# Altium schematic sheet DAC_32CH.SchDoc: DAC
size 420 x 297 mm; Author: G.K.; CompanyName: WUT; DrawnBy: G.K.; Organization: WUT ISE; Address1: Warsaw Univeristy of Technology; Address2: Nowowiejska 15/19; Revision: -; SheetNumber: -; SheetTotal: -; EDA_Number: ARTIQ; Projet: ARTIQ/SINARA; ModifiedBy: -; CreateDate: XX/XX/XXXX; CheckedDate: -; Title2: & reference; DivGrp: ISE; Designer: G.K.; ModifiedDate: -; ProjectName: 32 CHANNEL 16bit DAC
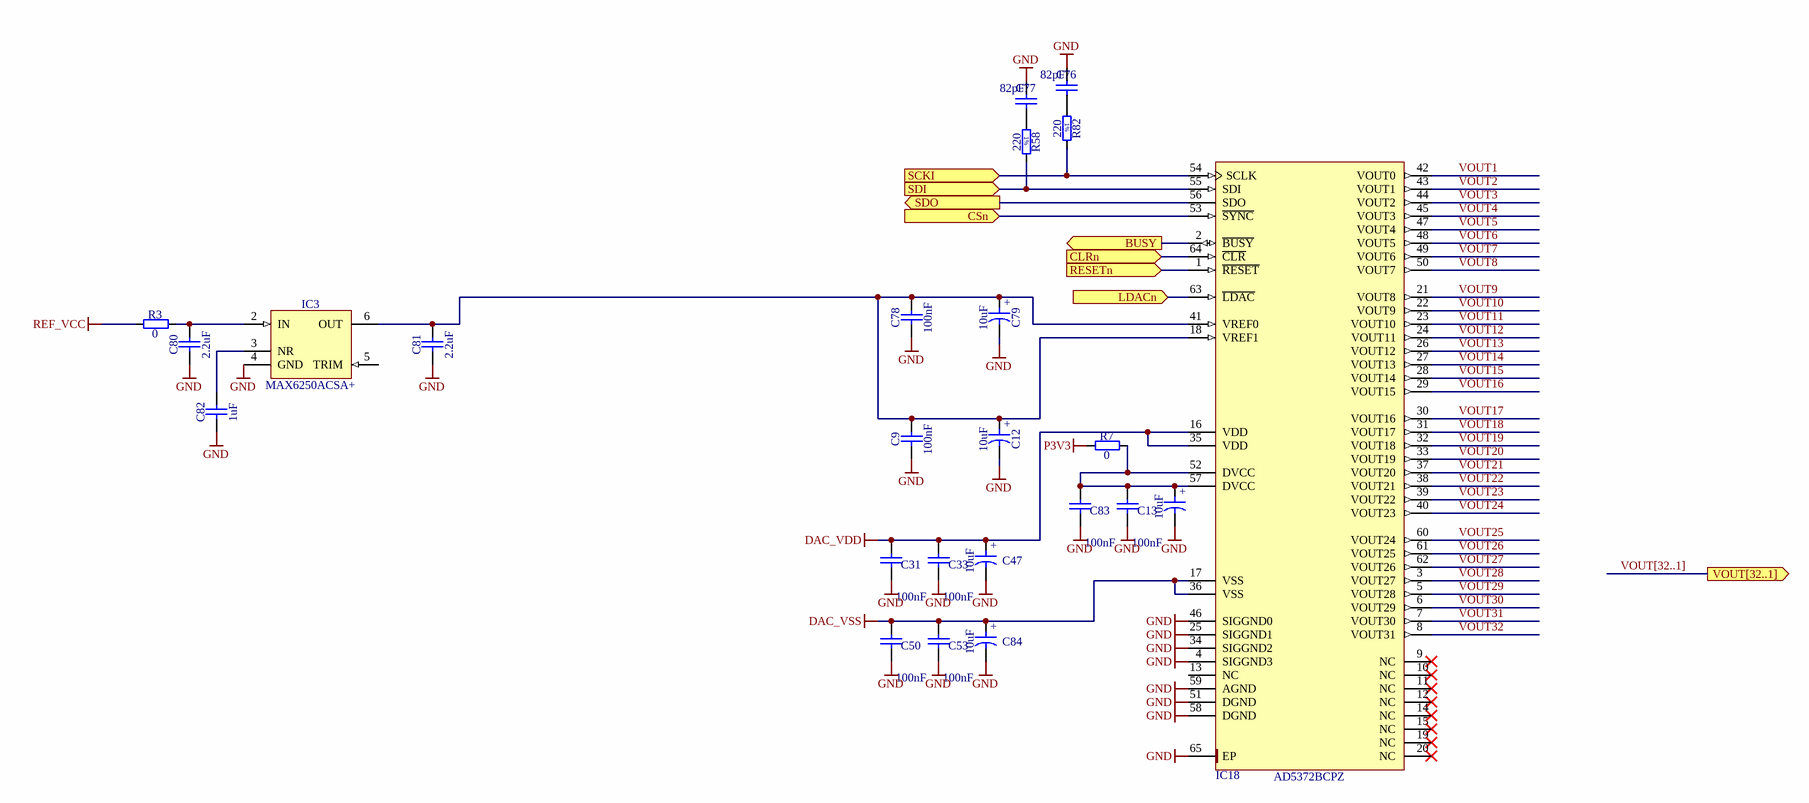
[diagram p0: DAC_32CH.SchDoc]

## Parts
C9  100nF  [CAPC1005X55N]
C12  10uF  [CAPMP3216X180N]
C13  100nF  [CAPC1005X55N]
C14  10uF  [CAPMP3216X180N]
C31  100nF  [CAPC1005X55N]
C33  100nF  [CAPC1005X55N]
C47  10uF  [CAPMP3216X180N]
C50  100nF  [CAPC1005X55N]
C53  100nF  [CAPC1005X55N]
C76  82pF  [CAPC1608X87N]
C77  82pF  [CAPC1608X87N]
C78  100nF  [CAPC1005X55N]
C79  10uF  [CAPMP3216X180N]
C80  2.2uF  [CAPC1608X87N]
C81  2.2uF  [CAPC1608X87N]
C82  1uF  [CAPC1608X87N]
C83  100nF  [CAPC1005X55N]
C84  10uF  [CAPMP3216X180N]
IC3  MAX6250ACSA+  [SOIC127P600X175-8N]
IC18  AD5372BCPZ  [QFN50P900X900X100-65N-S725]
R3  0  [RESC1005X40N]
R7  0  [RESC1005X40N]
R58  220  [RESC1608X55N]
R82  220  [RESC1608X55N]

## Ports
BUSY (out), CLRn (in), CSn (in), LDACn (in), RESETn (in), SCKI (in), SDI (in), SDO (out), VOUT[32..1] (out)

## Nets
DAC_VDD: C31.2 C33.2 C47.1 IC18.16(VDD) IC18.35(VDD)
DAC_VSS: C50.2 C53.2 C84.1 IC18.17(VSS) IC18.36(VSS)
GND: C9.1 C12.2 C13.1 C14.2 C31.1 C33.1 C47.2 C50.1 C53.1 C76.1 C77.1 C78.1 C79.2 C80.1 C81.1 C82.1 C83.1 C84.2 IC3.4(GND) IC18.4(SIGGND3) IC18.25(SIGGND1) IC18.34(SIGGND2) IC18.46(SIGGND0) IC18.51(DGND) IC18.58(DGND) IC18.59(AGND) IC18.65(EP)
P3V3: R7.1
REF_VCC: R3.1
BUSY: IC18.2(~{BUSY}) ; port BUSY
CLRn: IC18.64(~{CLR}) ; port CLRn
CSn: IC18.53(~{SYNC}) ; port CSn
LDACn: IC18.63(~{LDAC}) ; port LDACn
RESETn: IC18.1(~{RESET}) ; port RESETn
SCKI: IC18.54(SCLK) R82.2 ; port SCKI
SDI: IC18.55(SDI) R58.2 ; port SDI
SDO: IC18.56(SDO) ; port SDO
VOUT1: IC18.42(VOUT0)
VOUT2: IC18.43(VOUT1)
VOUT3: IC18.44(VOUT2)
VOUT4: IC18.45(VOUT3)
VOUT5: IC18.47(VOUT4)
VOUT6: IC18.48(VOUT5)
VOUT7: IC18.49(VOUT6)
VOUT8: IC18.50(VOUT7)
VOUT9: IC18.21(VOUT8)
VOUT10: IC18.22(VOUT9)
VOUT11: IC18.23(VOUT10)
VOUT12: IC18.24(VOUT11)
VOUT13: IC18.26(VOUT12)
VOUT14: IC18.27(VOUT13)
VOUT15: IC18.28(VOUT14)
VOUT16: IC18.29(VOUT15)
VOUT17: IC18.30(VOUT16)
VOUT18: IC18.31(VOUT17)
VOUT19: IC18.32(VOUT18)
VOUT20: IC18.33(VOUT19)
VOUT21: IC18.37(VOUT20)
VOUT22: IC18.38(VOUT21)
VOUT23: IC18.39(VOUT22)
VOUT24: IC18.40(VOUT23)
VOUT25: IC18.60(VOUT24)
VOUT26: IC18.61(VOUT25)
VOUT27: IC18.62(VOUT26)
VOUT28: IC18.3(VOUT27)
VOUT29: IC18.5(VOUT28)
VOUT30: IC18.6(VOUT29)
VOUT31: IC18.7(VOUT30)
VOUT32: IC18.8(VOUT31)
NetC9_2: C9.2 C12.1 C78.2 C79.1 C81.2 IC3.6(OUT) IC18.18(VREF1) IC18.41(VREF0)
NetC13_2: C13.2 C14.1 C83.2 IC18.52(DVCC) IC18.57(DVCC) R7.2
NetC76_2: C76.2 R82.1
NetC77_2: C77.2 R58.1
NetC80_2: C80.2 IC3.2(IN) R3.2
NetC82_2: C82.2 IC3.3(NR)

Not connected (* = marked no-connect by the designer): IC3 5(TRIM); IC18 9(NC)* 10(NC)* 11(NC)* 12(NC)* 13(NC) 14(NC)* 15(NC)* 19(NC)* 20(NC)*

## Buses and harness runs
bus VOUT[32..1] = port VOUT[32..1]

## Notes on the sheet
- Project/Equipment
- Document
- Designer
- Drawn by
- Check.by
- File
- Last Mod.
- Print Date
- Sheet
- Size
- A3
- of
- Rev
- (in symbol CTE3216-18_10UF_16V_20%_AVX_TCJ) +
- (in symbol R0603_220R_1%_0.1W_100PPM) 1%

## Library data of the parts
C9 C13 C31 C33 C50 C53 C78 C83 = CC0402_100NF_16V_10%_X7R: Non-polarised capacitor; Part Description: SMD Multilayer Chip Ceramic Capacitor; Manufacturer: GENERIC; Manufacturer1 Part Number: GRM155R71C104KA88D; Voltage: 16V; TC: X7R; Tolerance: ±10%; Part Number: CC0402_100NF_16V_10%_X7R; Component Kind: Standard; Component Type: Standard; Pin Count: 2; Value: 100nF; Status: Not Recommended; Manufacturer Part Number: CC0402_100NF_16V_10%_X7R; Case: 0402; Mounted: Yes; Socket: No; SMD: Yes; Sense: No; Manufacturer1 Example: MURATA; Manufacturer1 ComponentHeight: 0.55mm; HelpURL: \\cern.ch\dfs\Applications\Altium\Datasheets\CC0402_X7R_MURATA_GRM.pdf; Author: CERN DEM JLC
  C9 C78: CreateDate: 2013-12-05; LatestRevisionDate: 2007-12-03
  C13 C31 C33 C50 C53 C83: CreateDate: 05.12.2013; LatestRevisionDate: 03.12.2007
C12 C14 C47 C79 C84 = CTE3216-18_10UF_16V_20%_AVX_TCJ: Polarised capacitor; Part Description: ESR 0R200 Tantalum Solid Electrolytic Chip Capacitor with Conductive Polymer Electrode; Manufacturer: AVX; Manufacturer Part Number: TCJA106M016R0200; Voltage: 16V; Tolerance: ±20%; Part Number: CTE3216-18_10UF_16V_20%_AVX_TCJ; Component Kind: Standard; Component Type: Standard; Pin Count: 2; Value: 10uF; Status: Preferred; Case: A; Mounted: Yes; Socket: No; SMD: Yes; Sense: No; ComponentHeight: 1.8mm; HelpURL: \\cern.ch\dfs\Applications\Altium\Datasheets\CTE_AVX_TCJ.pdf; Author: CERN DEM JLC; CreateDate: 29.03.2012; LatestRevisionDate: 29.03.2012
C76 C77 = CC0603_82PF_50V_5%_NP0: Non-polarised capacitor; Part Description: SMD Multilayer Chip Ceramic Capacitor; Manufacturer: GENERIC; Manufacturer1 Part Number: 223886715829; Voltage: 50V; TC: C0G/NP0; Tolerance: ±5%; Part Number: CC0603_82PF_50V_5%_NP0; Component Kind: Standard; Component Type: Standard; Pin Count: 2; Value: 82pF; Status: Preferred; Manufacturer Part Number: CC0603_82PF_50V_5%_NP0; Case: 0603; Mounted: Yes; Socket: No; SMD: Yes; Sense: No; Manufacturer1 Example: PHYCOMP; Manufacturer1 ComponentHeight: 0.87mm; HelpURL: \\cern.ch\dfs\Applications\Altium\Datasheets\CC0603_NP0_PHYCOMP.pdf; Author: CERN DEM JLC; CreateDate: 03.12.2007; LatestRevisionDate: 03.12.2007
C80 C81 = CC0603_2.2UF_16V_10%_X5R: Non-polarised capacitor; Part Description: SMD Multilayer Chip Ceramic Capacitor; Manufacturer: GENERIC; Manufacturer1 Part Number: CC0603KRX5R7BB225; Voltage: 16V; TC: X5R; Tolerance: ±10%; Part Number: CC0603_2.2UF_16V_10%_X5R; Component Kind: Standard; Component Type: Standard; Pin Count: 2; Value: 2.2uF; Status: Preferred; Manufacturer Part Number: CC0603_2.2UF_16V_10%_X5R; Case: 0603; Mounted: Yes; Socket: No; SMD: Yes; Sense: No; Manufacturer1 Example: YAGEO; Manufacturer1 ComponentHeight: 0.9mm; HelpURL: \\cern.ch\dfs\Applications\Altium\Datasheets\CC0805_X5R_PHYCOMP_HC.pdf; Author: CERN DEM JLC; CreateDate: 28.04.2011; LatestRevisionDate: 28.04.2011
C82 = CC0603_1UF_25V_10%_X7R: Non-polarised capacitor; Part Description: SMD Multilayer Chip Ceramic Capacitor; Manufacturer: GENERIC; Manufacturer1 Part Number: GRM188R71E105KA12D; Voltage: 25V; TC: X7R; Tolerance: ±10%; Part Number: CC0603_1UF_25V_10%_X7R; Component Kind: Standard; Component Type: Standard; Pin Count: 2; Value: 1uF; Status: None; Manufacturer Part Number: CC0603_1UF_25V_10%_X7R; Case: 0603; Mounted: Yes; Socket: No; SMD: Yes; Sense: No; Manufacturer1 Example: MURATA; Manufacturer1 ComponentHeight: 0.9mm; HelpURL: \\cern.ch\dfs\Applications\Altium\Datasheets\CC0603_X7R_MURATA.pdf; Author: CERN DEM JLC; CreateDate: 18.01.2011; LatestRevisionDate: 18.01.2011
IC3 = MAX6250ACSA+: 1ppm/°C, Low-Noise, Precision, +5.000V Voltage Reference; Manufacturer: MAXIM; PressFit: No; Bonding: No; Part Number: MAX6250ACSA+; Component Kind: Standard; Component Type: Standard; Device: MAX6250ACSA+; PackageDescription: SOIC 8, Pitch 1.27mm, Body 4x5mm, IPC Medium Density; Part Description: 1ppm/°C, Low-Noise, Precision, +5.000V Voltage Reference; Manufacturer Part Number: MAX6250ACSA+; Pin Count: 5; Case: SOIC8; Mounted: Yes; Socket: No; SMD: Yes; Sense: No; ComponentHeight: 1.75mm; HelpURL: \\cern.ch\dfs\Applications\Altium\Datasheets\MAX6250ACSA+.pdf; Author: CERN DEM JMW; CreateDate: 06.07.2015; LatestRevisionDate: 06.07.2015
IC18 = DAC_AD5372: 32-Channel, 16-Bit, Serial Input, Voltage Output Digital-to-Analog Converter; Manufacturer: ANALOG DEVICES; PressFit: No; Bonding: No; Part Number: AD5372BCPZ; Component Kind: Standard; Component Type: Standard; Device: AD5372BCPZ; PackageDescription: QFN, 0.50mm Pitch, Square; 64 Pin, 9.00mm L X 9.00mm W X 1.00mm H Body (7.25 X 7.25mm Thermal Tab), IPC Medium Density; Part Description: 32-Channel, 16-Bit, Serial Input, Voltage Output Digital-to-Analog Converter; Manufacturer Part Number: AD5372BCPZ; Pin Count: 65; Case: QFN64; Mounted: Yes; Socket: No; SMD: Yes; Sense: No; ComponentHeight: 1mm; Author: GK; HelpURL: \\cern.ch\dfs\Applications\Altium\Datasheets\AD5373BCPZ.pdf; CreateDate: 14.03.2017; LatestRevisionDate: 14.03.2017
R3 R7 = R0402_0R_JUMPER: Resistor; Part Description: 1A (0.05R Max DC Resistance) Zero Ohm Jumper; Manufacturer: GENERIC; Manufacturer1 Part Number: 232270591001L; Part Number: R0402_0R_JUMPER; Component Kind: Standard; Component Type: Standard; Pin Count: 2; Value: 0; Status: Not recommended; Manufacturer Part Number: R0402_0R_JUMPER; Case: 0402; Mounted: Yes; Sense: No; Socket: No; SMD: Yes; Manufacturer1 Example: YAGEO PHYCOMP; Manufacturer1 ComponentHeight: 0.4mm; HelpURL: \\cern.ch\dfs\Applications\Altium\Datasheets\R0402_Phycomp_RC0402.pdf; Author: CERN DEM JLC; CreateDate: 03.12.2007; LatestRevisionDate: 17.10.2012
R58 R82 = R0603_220R_1%_0.1W_100PPM: Resistor - 1%; Part Description: General Purpose Thick Film Chip Resistor; Manufacturer: GENERIC; Manufacturer1 Part Number: NRC06F2200TRF; Power: 0.1W; TC: ±100ppm/°C; Part Number: R0603_220R_1%_0.1W_100PPM; Component Kind: Standard; Component Type: Standard; Pin Count: 2; Value: 220; Status: Preferred; Tolerance: ±1%; Manufacturer Part Number: R0603_220R_1%_0.1W_100PPM; Case: 0603; Mounted: Yes; Sense: No; Socket: No; SMD: Yes; Manufacturer1 Example: NIC COMPONENT; Manufacturer1 ComponentHeight: 0.55mm; HelpURL: \\cern.ch\dfs\Applications\Altium\Datasheets\R0603_NIC_NRC.pdf; Author: CERN DEM JLC; CreateDate: 03.12.2007; LatestRevisionDate: 13.03.2008